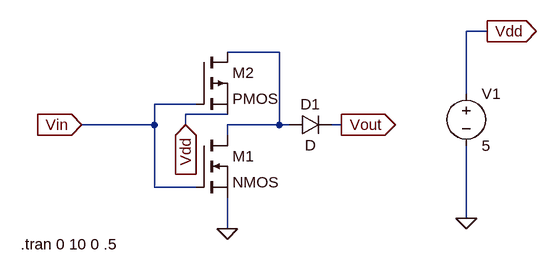
[diagram p0: schematic NOT_gate (2).asc]
NOT_gate (2).asc, the LTspice schematic file:
Version 4
SHEET 1 1232 680
WIRE 624 48 592 48
WIRE 304 80 224 80
WIRE 592 144 592 48
WIRE 176 160 112 160
WIRE 224 176 160 176
WIRE 112 192 112 160
WIRE 112 192 0 192
WIRE 160 192 160 176
WIRE 304 192 304 80
WIRE 304 192 224 192
WIRE 320 192 304 192
WIRE 400 192 384 192
WIRE 224 208 224 192
WIRE 112 288 112 192
WIRE 176 288 112 288
WIRE 592 336 592 224
WIRE 224 352 224 304
FLAG 400 192 Vout
IOPIN 400 192 Out
FLAG 0 192 Vin
IOPIN 0 192 In
FLAG 160 192 Vdd
IOPIN 160 192 In
FLAG 592 336 0
FLAG 624 48 Vdd
IOPIN 624 48 Out
FLAG 224 352 0
SYMBOL nmos 176 208 R0
SYMATTR InstName M1
SYMBOL pmos 176 80 R0
SYMATTR InstName M2
SYMBOL voltage 592 128 R0
WINDOW 123 0 0 Left 0
WINDOW 39 0 0 Left 0
SYMATTR InstName V1
SYMATTR Value 5
SYMBOL diode 320 208 R270
WINDOW 0 32 32 VTop 2
WINDOW 3 0 32 VBottom 2
SYMATTR InstName D1
TEXT -94 376 Left 2 !.tran 0 10 0 .5

The netlist it stands for:
* NOT_gate (2).asc
M1 N001 Vin 0 0 NMOS
M2 N001 Vin Vdd Vdd PMOS
V1 Vdd 0 5
D1 N001 Vout D
.model D D
.lib standard.dio
.model NMOS NMOS
.model PMOS PMOS
.lib standard.mos
.tran 0 10 0 .5
.backanno
.end